# Altium schematic sheet MPPT_V1.0.1_MCU_and_Display.SchDoc: MPPT_V1.0
size A4; DrawnBy: Hugo Boyce; Engineer: Hugo Boyce; Organization: Altium Limited; Address1: L3, 12a Rodborough Rd; Address2: Frenchs Forest; Address3: NSW; Address4: Australia 2086; SheetNumber: 2; SheetTotal: 5
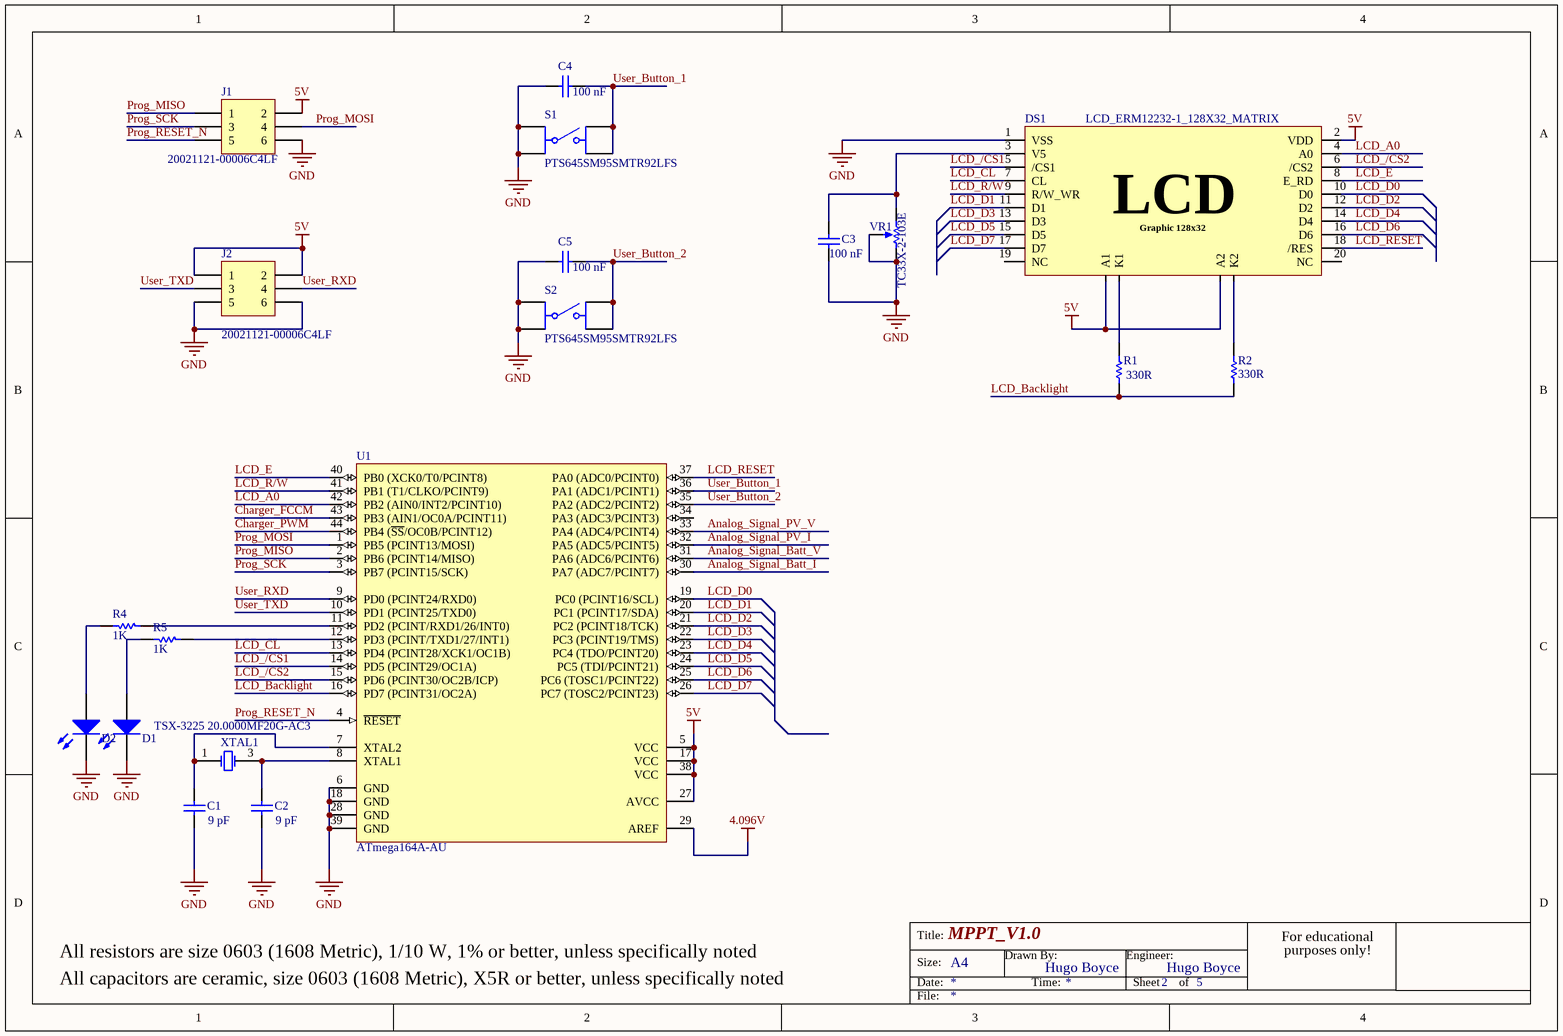
[diagram p0: MPPT_V1.0.1_MCU_and_Display.SchDoc]

## Parts
C1  value 9 pF  [CAPC1608N]  (hidden comment: Cap SMD)
C2  value 9 pF  [CAPC1608N]  (hidden comment: Cap SMD)
C3  value 100 nF  [CAPC1608N]  (hidden comment: Cap SMD)
C4  value 100 nF  [CAPC1608N]  (hidden comment: Cap SMD)
C5  value 100 nF  [CAPC1608N]  (hidden comment: Cap SMD)
D1  150120RS75000  [150120RS75000]  (value not drawn)
D2  150120RS75000  [150120RS75000]  (value not drawn)
DS1  LCD_ERM12232-1_128X32_MATRIX  [LCD_ERM12232]
J1  20021121-00006C4LF  [20021121-00006]
J2  20021121-00006C4LF  [20021121-00006]
R1  value 330R  [RESC1608N]  (hidden comment: Res SMD)
R2  value 330R  [RESC1608N]  (hidden comment: Res SMD)
R4  value 1K  [RESC1608N]  (hidden comment: Res SMD)
R5  value 1K  [RESC1608N]  (hidden comment: Res SMD)
S1  PTS645SM95SMTR92LFS  [PTS645SM95SMTR92LFS]
S2  PTS645SM95SMTR92LFS  [PTS645SM95SMTR92LFS]
U1  ATmega164A-AU  [44A_N]
VR1  TC33X-2-103E  [TC33_BOURNS]
XTAL1  TSX-3225 20.0000MF20G-AC3  [EPSON_TSX-3225]

## Nets
4.096V: U1.29(AREF)
5V: DS1.2(VDD) DS1.21(A1) DS1.23(A2) J1.2 J2.1 J2.2 U1.5(VCC) U1.17(VCC) U1.27(AVCC) U1.38(VCC)
GND: C1.1 C2.1 C3.1 C4.2 C5.2 D1.1(K) D2.1(K) DS1.1(VSS) J1.6 J2.5 J2.6 S1.1 S1.3 S2.1 S2.3 U1.6(GND) U1.18(GND) U1.28(GND) U1.39(GND) VR1.1(CCW) VR1.2(WIPER)
Analog_Signal_Batt_I: U1.30(PA7_(ADC7/PCINT7))
Analog_Signal_Batt_V: U1.31(PA6_(ADC6/PCINT6))
Analog_Signal_PV_I: U1.32(PA5_(ADC5/PCINT5))
Analog_Signal_PV_V: U1.33(PA4_(ADC4/PCINT4))
Charger_FCCM: U1.43(PB3_(AIN1/OC0A/PCINT11))
Charger_PWM: U1.44(PB4_(~{SS}/OC0B/PCINT12))
LCD_/CS1: DS1.5(/CS1) U1.14(PD5_(PCINT29/OC1A))
LCD_/CS2: DS1.6(/CS2) U1.15(PD6_(PCINT30/OC2B/ICP))
LCD_A0: DS1.4(A0) U1.42(PB2_(AIN0/INT2/PCINT10))
LCD_Backlight: R1.1 R2.1 U1.16(PD7_(PCINT31/OC2A))
LCD_CL: DS1.7(CL) U1.13(PD4_(PCINT28/XCK1/OC1B))
LCD_D0: DS1.10(D0) U1.19(PC0_(PCINT16/SCL))
LCD_D1: DS1.11(D1) U1.20(PC1_(PCINT17/SDA))
LCD_D2: DS1.12(D2) U1.21(PC2_(PCINT18/TCK))
LCD_D3: DS1.13(D3) U1.22(PC3_(PCINT19/TMS))
LCD_D4: DS1.14(D4) U1.23(PC4_(TDO/PCINT20))
LCD_D5: DS1.15(D5) U1.24(PC5_(TDI/PCINT21))
LCD_D6: DS1.16(D6) U1.25(PC6_(TOSC1/PCINT22))
LCD_D7: DS1.17(D7) U1.26(PC7_(TOSC2/PCINT23))
LCD_E: DS1.8(E_RD) U1.40(PB0_(XCK0/T0/PCINT8))
LCD_R/W: DS1.9(R/W_WR) U1.41(PB1_(T1/CLKO/PCINT9))
LCD_RESET: DS1.18(/RES) U1.37(PA0_(ADC0/PCINT0))
Prog_MISO: J1.1 U1.2(PB6_(PCINT14/MISO))
Prog_MOSI: J1.4 U1.1(PB5_(PCINT13/MOSI))
Prog_RESET_N: J1.5 U1.4(~{RESET})
Prog_SCK: J1.3 U1.3(PB7_(PCINT15/SCK))
User_Button_1: C4.1 S1.2 S1.4 U1.36(PA1_(ADC1/PCINT1))
User_Button_2: C5.1 S2.2 S2.4 U1.35(PA2_(ADC2/PCINT2))
User_RXD: J2.4 U1.9(PD0_(PCINT24/RXD0))
User_TXD: J2.3 U1.10(PD1_(PCINT25/TXD0))
NetC1_2: C1.2 U1.7(XTAL2) XTAL1.1(OSC1)
NetC2_2: C2.2 U1.8(XTAL1) XTAL1.3(OSC2)
NetC3_2: C3.2 DS1.3(V5) VR1.3(CW)
NetD1_2: D1.2(A) R5.2
NetD2_2: D2.2(A) R4.2
NetDS1_22: DS1.22(K1) R1.2
NetDS1_24: DS1.24(K2) R2.2
NetR4_1: R4.1 U1.11(PD2_(PCINT/RXD1/26/INT0))
NetR5_1: R5.1 U1.12(PD3_(PCINT/TXD1/27/INT1))

Not connected (* = marked no-connect by the designer): DS1 19(NC) 20(NC); U1 34(PA3_(ADC3/PCINT3))

## Notes on the sheet
- All resistors are size 0603 (1608 Metric), 1/10 W, 1% or better, unless specifically noted
- All capacitors are ceramic, size 0603 (1608 Metric), X5R or better, unless specifically noted
- Title:
- Size:
- Date:
- A4
- Drawn By:
- Time:
- Engineer:
- Sheet
- of
- For educational
- purposes only!
- File:
- (in symbol LCD_ERM12232-1_128X64_MATRIX) LCD; Graphic 128x32

## Library data of the parts
C1-C5 = Cap SMD: Capacitor; Published: 8-Jun-2000; LatestRevisionDate: 17-Jul-2002; LatestRevisionNote: Re-released for DXP Platform.; PackageReference: RAD-0.3; Publisher: Altium Limited; PackageDescription: Radial Cap, Thru-Hole; 2 Leads; 0.3 in Pin Spacing
D1 D2 = 150120RS75000: LED RED CLEAR 1206 SMD; Manufacturer: Wurth Electronics Inc.; Lens Color: Colorless; Millicandela Rating: 150mcd; Lens Style/Size: Rectangle with Flat Top, 2.00mm x 1.60mm; Voltage - Forward (Vf) (Typ): 2V; Current - Test: 20mA; Viewing Angle: 140°; Wavelength - Dominant: 625nm; Wavelength - Peak: 630nm; Supplier 1: Digi-Key; RoHS: RoHS Compliant; Category: Optoelectronics; Stock 1: 14076; Pricing 1: 1=0.27, 50=0.2582, 100=0.2211, 500=0.18952 (CAD); Packaging: Cut Tape (CT); Part Status: Active; Color: Red; Lens Transparency: Clear; Mounting Type: Surface Mount; Features: -; Package / Case: 1206 (3216 Metric); Supplier Device Package: 1206; Size / Dimension: 3.20mm L x 1.60mm W; Height (Max): 0.69mm; ComponentLink1URL: http://katalog.we-online.de/led/datasheet/150120RS75000.pdf; ComponentLink1Description: http://katalog.we-online.de/led/datasheet/150120RS75000.pdf; Supplier Part Number 1: 732-4991-1-ND; Manufacturer Part Number: 150120RS75000
DS1 = LCD_ERM12232-1_128X64_MATRIX: 128x64 Graphic LCD Module, EastRising
J1 J2 = 20021121-00006C4LF: CONN HEADER 6POS DL UNSHRD SMD; Manufacturer: Amphenol FCI; Pitch - Mating: 0.050" (1.27mm); Number of Positions: 6; Number of Positions Loaded: All; Style: Board to Board; Shrouding: Unshrouded; Contact Length - Mating: 0.120" (3.05mm); Material Flammability Rating: UL94 V-0; Supplier 1: Digi-Key; RoHS: RoHS Compliant; Category: Connectors, Interconnects; Stock 1: 40686; Pricing 1: 1=0.73, 10=0.683, 100=0.523 (CAD); Packaging: Cut Tape (CT); Part Status: Active; Connector Type: Header; Contact Type: Male Pin; Number of Rows: 2; Row Spacing - Mating: 0.050" (1.27mm); Mounting Type: Surface Mount; Termination: Solder; Fastening Type: Push-Pull; Contact Length - Post: -; Overall Contact Length: -; Insulation Height: -; Contact Shape: Square; Contact Finish - Mating: Gold; Contact Finish Thickness - Mating: 10µin (0.25µm); Contact Finish - Post: Tin; Contact Material: Copper Alloy; Insulation Material: Thermoplastic; Features: Pick and Place; Operating Temperature: -; Ingress Protection: -; Insulation Color: Black; Current Rating: -; Voltage Rating: -; Mated Stacking Heights: -; Contact Finish Thickness - Post: 50µin (1.27µm); Applications: -; ComponentLink1URL: https://cdn.amphenol-icc.com/media/wysiwyg/files/drawing/20021121.pdf; ComponentLink1Description: https://cdn.amphenol-icc.com/media/wysiwyg/files/drawing/20021121.pdf; Supplier Part Number 1: 609-3693-1-ND; Manufacturer Part Number: 20021121-00006C4LF
R1 R2 R4 R5 = Res SMD: Resistor; Published: 8-Jun-2000; LatestRevisionDate: 17-Jul-2002; LatestRevisionNote: Re-released for DXP Platform.; PackageReference: AXIAL-0.3; Publisher: Altium Limited; PackageDescription: Axial Device, Thru-Hole; 2 Leads; 0.3 in Pin Spacing
S1 S2 = PTS645SM95SMTR92LFS: SWITCH TACTILE SPST-NO 0.05A 12V; Manufacturer: C&K; Switch Function: Off-Mom; Contact Rating @ Voltage: 0.05A @ 12VDC; Actuator Type: Standard; Actuator Height off PCB, Vertical: 9.50mm; Actuator Orientation: Top Actuated; Outline: 6.00mm x 6.00mm; Illumination: Non-Illuminated; Operating Force: 160gf; Actuator Material: Polyamide (PA66), Nylon 6/6; Mechanical Life: 100,000 Cycles; Supplier 1: Digi-Key; RoHS: RoHS Compliant; Category: Switches; Stock 1: 8178; Pricing 1: 1=0.41, 10=0.404, 25=0.3896, 50=0.3752, 100=0.3545, 250=0.3336 (CAD); Packaging: Cut Tape (CT); Part Status: Active; Circuit: SPST-NO; Mounting Type: Surface Mount; Actuator Length, Right Angle: -; Termination Style: Gull Wing; Illumination Type, Color: -; Illumination Voltage (Nominal): -; Ingress Protection: -; Features: Blue Actuator; Switch Travel: -; Operating Temperature: -20°C ~ 60°C; ComponentLink1URL: http://www.ckswitches.com/media/1471/pts645.pdf; ComponentLink1Description: http://www.ckswitches.com/media/1471/pts645.pdf; Supplier Part Number 1: CKN10822CT-ND; Manufacturer Part Number: PTS645SM95SMTR92LFS
U1 = ATmega164A-AU: 8-bit AVR Microcontroller, 16KB Flash, 512 Bytes EEPROM, 1KB SRAM, 44-pin TQFP, Industrial Grade (-40°C to 85°C); Published: 1-Apr-2010; DatasheetVersion: revA, Jan-2010; PackageVersion: rev.B, Oct-2001; PackageReference: 44A; Publisher: Altium Limited; PackageDescription: 44-Pin Plastic Thin Profile Quad Flat Pack, 10 x 10 x 1.0 mm Body, 0.8 mm Pitch (TQFP); Supplier 1: Digi-Key; Supplier Part Number 1: ATMEGA164A-AU-ND; Supplier 2: Mouser; Supplier Part Number 2: 556-ATMEGA164A-AU; ComponentLink1Description: Manufacturer Link; ComponentLink1URL: http://www.atmel.com/products/avr/default.asp?; ComponentLink2Description: ATmega164A/164PA/324A/324PA/644A/644PA/1284/1284P Datasheet; ComponentLink2URL: http://www.atmel.com/dyn/resources/prod_documents/doc8272.pdf; ComponentLink3Description: ATmega164A/164PA/324A/324PA/644A/644PA/1284/1284P Summary; ComponentLink3URL: http://www.atmel.com/dyn/resources/prod_documents/8272S.pdf; ComponentLink4Description: Atmel.com Home; ComponentLink4URL: http://www.atmel.com
VR1 = TC33X-2-103E: TRIMMER 10K OHM 0.1W SMD; Manufacturer: Bourns Inc.; Power (Watts): 0.1W, 1/10W; Tolerance: ±25%; Temperature Coefficient: ±250ppm/°C; Adjustment Type: Top Adjustment; Resistive Material: Cermet; Supplier 1: Digi-Key; RoHS: RoHS Compliant; Category: Potentiometers, Variable Resistors; Stock 1: 75902; Pricing 1: 1=0.41, 10=0.405, 25=0.366, 50=0.3492, 100=0.3378, 250=0.31532, 500=0.28716, 1000=0.259 (CAD); Packaging: Cut Tape (CT); Part Status: Active; Mounting Type: Surface Mount; Termination Style: J Lead; Size / Dimension: Rectangular - 0.150" x 0.142" Face x 0.047" H (3.80mm x 3.60mm x 1.20mm); ComponentLink1URL: http://www.bourns.com/docs/Product-Datasheets/TC33.pdf; ComponentLink1Description: http://www.bourns.com/docs/Product-Datasheets/TC33.pdf; Supplier Part Number 1: TC33X-103ECT-ND; Manufacturer Part Number: TC33X-2-103E
XTAL1 = TSX-3225 20.0000MF20G-AC3: CRYSTAL 20.0000MHZ 9PF SMD; Manufacturer: EPSON; Frequency Stability: ±20ppm; Frequency Tolerance: ±10ppm; Operating Mode: Fundamental; Supplier 1: Digi-Key; RoHS: RoHS Compliant; Category: Crystals, Oscillators, Resonators; Stock 1: 5308; Pricing 1: 1=0.77, 10=0.643, 50=0.578, 100=0.5136 (CAD); Packaging: Cut Tape (CT); Part Status: Active; Type: MHz Crystal; Load Capacitance: 9pF; Operating Temperature: -40°C ~ 105°C; Ratings: -; Mounting Type: Surface Mount; Package / Case: 4-SMD, No Lead; Size / Dimension: 0.126" L x 0.098" W (3.20mm x 2.50mm); Height - Seated (Max): 0.024" (0.60mm); ComponentLink1URL: https://support.epson.biz/td/api/doc_check.php?dl=brief_FA-238V_en.pdf; ComponentLink1Description: https://support.epson.biz/td/api/doc_check.php?dl=brief_FA-238V_en.pdf; Supplier Part Number 1: SER3629CT-ND; Manufacturer Part Number: TSX-3225 20.0000MF20G-AC3